# EAGLE design mrShark Adapter (EAGLE 7.2.0)
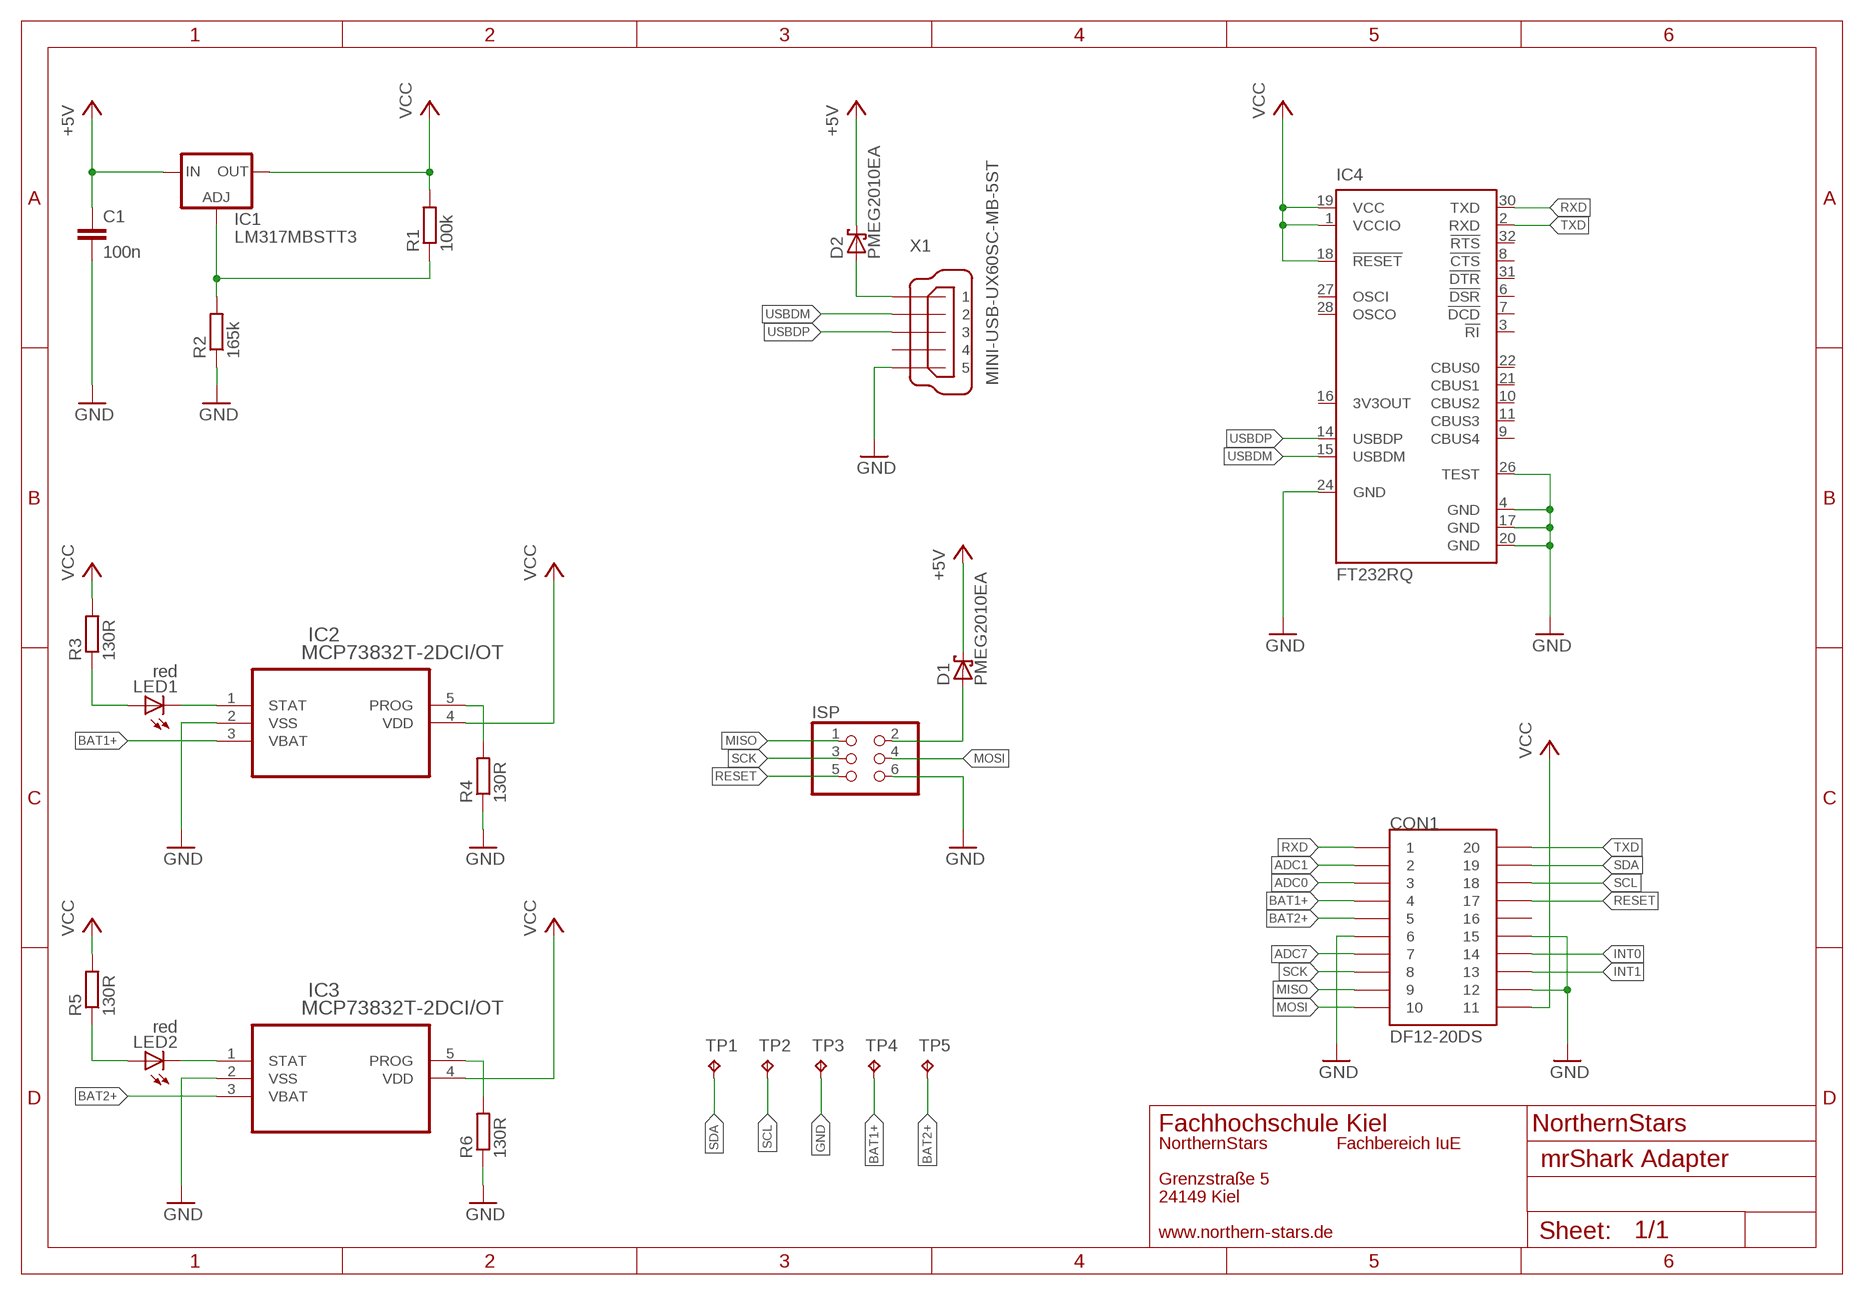
[diagram p0: schematic, sheet 1]

## Parts
C1  100n  C-EUC0603  [C0603]
CON1  DF12-20DS  [DF12-20DS]
D1  PMEG2010EA  PMEG2010EAR  [SOD323-R]
D2  PMEG2010EA  PMEG2010EAR  [SOD323-R]
IC1  LM317MBSTT3  [SOT223]
IC2  MCP73832T-2DCI/OT  [SOT95P300X145-5N]
IC3  MCP73832T-2DCI/OT  [SOT95P300X145-5N]
IC4  FT232RQ  [QFN32]
ISP  PINHD-2X03_2.54-SMD  [2X03SMD]
LED1  red  LEDCHIP-LED0603  [CHIP-LED0603]
LED2  red  LEDCHIP-LED0603  [CHIP-LED0603]
R1  100k  R-EU_R0603  [R0603]
R2  165k  R-EU_R0603  [R0603]
R3  130R  R-EU_R0603  [R0603]
R4  130R  R-EU_R0603  [R0603]
R5  130R  R-EU_R0603  [R0603]
R6  130R  R-EU_R0603  [R0603]
TP1  TPTP06SQ  [TP06SQ]
TP2  TPTP06SQ  [TP06SQ]
TP3  TPTP06SQ  [TP06SQ]
TP4  TPTP06SQ  [TP06SQ]
TP5  TPTP06SQ  [TP06SQ]
X1  MINI-USB-UX60SC-MB-5ST  [UX60SC-MB-5ST]

## Nets
+5V: C1.1 D1.C D2.C IC1.3(IN)
ADC0: CON1.3
ADC1: CON1.2
ADC7: CON1.7
BAT1+: CON1.4 IC2.3(VBAT) TP4.TP
BAT2+: CON1.5 IC3.3(VBAT) TP5.TP
GND: C1.2 CON1.6 CON1.12 CON1.15 IC2.2(VSS) IC3.2(VSS) IC4.4(GND) IC4.17(GND) IC4.20(GND) IC4.24(GND) IC4.26(TEST) ISP.6 R2.1 R4.1 R6.1 TP3.TP X1.5
INT0: CON1.14
INT1: CON1.13
MISO: CON1.9 ISP.1
MOSI: CON1.10 ISP.4
N$1: IC1.1(ADJ) R1.1 R2.2
N$2: IC2.1(STAT) LED1.C
N$3: LED1.A R3.1
N$4: D1.A ISP.2
N$5: IC2.5(PROG) R4.2
N$6: LED2.A R5.1
N$7: IC3.1(STAT) LED2.C
N$8: IC3.5(PROG) R6.2
N$9: D2.A X1.1
RESET: CON1.17 ISP.5
RXD: CON1.1 IC4.30(TXD)
SCK: CON1.8 ISP.3
SCL: CON1.18 TP2.TP
SDA: CON1.19 TP1.TP
TXD: CON1.20 IC4.2(RXD)
USBDM: IC4.15(USBDM) X1.2
USBDP: IC4.14(USBDP) X1.3
VCC: CON1.11 IC1.4(OUT) IC2.4(VDD) IC3.4(VDD) IC4.1(VCCIO) IC4.18(!RESET) IC4.19(VCC) R1.2 R3.2 R5.2
Unconnected: CON1.16 IC4.3(!RI) IC4.6(!DSR) IC4.7(!DCD) IC4.8(!CTS) IC4.9(CBUS4) IC4.10(CBUS2) IC4.11(CBUS3) IC4.16(3V3OUT) IC4.21(CBUS1) IC4.22(CBUS0) IC4.27(OSCI) IC4.28(OSCO) IC4.31(!DTR) IC4.32(!RTS) X1.4

## Notes on the sheet
- Fachhochschule Kiel | NorthernStars
- NorthernStars | Fachbereich IuE
- Grenzstraße 5
- 24149 Kiel
- www.northern-stars.de

## Library data of the parts
C1 = rcl:C-EU: CAPACITOR, European symbol
CON1 = con-hirose:DF12-20: HRS-Hirose DF12-Series 0.5mm Pitch SMT Board to Board Connector 20 contacts
D1 D2 = diode:PMEG2010EA: NXP - Low V F (MEGA) Schottky barrier diode If = 1A, Vr = 20V http://www.farnell.com/datasheets/687996.pdf
IC1 = v-reg:LM317?*: 500 mA Adjustable Output Positive Voltage Regulator Source: http://www.onsemi.co.jp .. LM317M-D.PDF
IC2 IC3 = microchip:MCP73832T-2DCI/OT: IC, BATT CHARGER, Li-Ion Li-Polymer, 500 mA; MPN: MCP73832T-2DCI/OT; OC_FARNELL: 1834892; OC_NEWARK: 84R5198; PACKAGE: SOT23-5; SUPPLIER: Microchip
IC4 = ftdichip:FT232R: Source: http://www.ftdichip.com/Documents/DataSheets/DS_FT232R_v104.pdf
ISP = pinhead-2:PINHD-2X03: PIN HEADER
LED1 LED2 = led:LED: LED OSRAM: - CHIPLED LG R971, LG N971, LY N971, LG Q971, LY Q971, LO R971, LY R971 LH N974, LH R974 LS Q976, LO Q976, LY Q976 LO Q996 - Hyper CHIPLED LW Q18S LB Q993, LB Q99A, LB R99A - SideLED LS A670, LO A670, LY A670, LG A670, LP A670 LB A673, LV A673, LT A673, LW A673 LH A674 LY A675 LS A676, LA A676, LO A676, LY A676, LW A676 LS A679, LY A679, LG A679 - Hyper Micro SIDELED® LS Y876, LA Y876, LO Y876, LY Y876 LT Y87S - SmartLED LW L88C, LW L88S LB L89C, LB L89S, LG L890 LS L89K, LO L89K, LY L89K LS L896, LA L896, LO L896, LY L896 - TOPLED LS T670, LO T670, LY T670, LG T670, LP T670 LSG T670, LSP T670, LSY T670, LOP T670, LYG T670 LG T671, LOG T671, LSG T671 LB T673, LV T673, LT T673, LW T673 LH T674 LS T676, LA T676, LO T676, LY T676, LB T676, LH T676, LSB T676, LW T676 LB T67C, LV T67C, LT T67C, LS T67K, LO T67K, LY T67K, LW E67C LS E67B, LA E67B, LO E67B, LY E67B, LB E67C, LV E67C, LT E67C LW T67C LS T679, LY T679, LG T679 LS T770, LO T770, LY T770, LG T770, LP T770 LB T773, LV T773, LT T773, LW T773 LH T774 LS E675, LA E675, LY E675, LS T675 LS T776, LA T776, LO T776, LY T776, LB T776 LHGB T686 LT T68C, LB T68C - Hyper Mini TOPLED® LB M676 - Mini TOPLED Santana® LG M470 LS M47K, LO M47K, LY M47K Source: http://www.osram.convergy.de LUXEON: - LUMILED® LXK2-PW12-R00, LXK2-PW12-S00, LXK2-PW14-U00, LXK2-PW14-V00 LXK2-PM12-R00, LXK2-PM12-S00, LXK2-PM14-U00 LXK2-PE12-Q00, LXK2-PE12-R00, LXK2-PE12-S00, LXK2-PE14-T00, LXK2-PE14-U00 LXK2-PB12-K00, LXK2-PB12-L00, LXK2-PB12-M00, LXK2-PB14-N00, LXK2-PB14-P00, LXK2-PB14-Q00 LXK2-PR12-L00, LXK2-PR12-M00, LXK2-PR14-Q00, LXK2-PR14-R00 LXK2-PD12-Q00, LXK2-PD12-R00, LXK2-PD12-S00 LXK2-PH12-R00, LXK2-PH12-S00 LXK2-PL12-P00, LXK2-PL12-Q00, LXK2-PL12-R00 Source: www.luxeon.com KINGBRIGHT: KA-3528ASYC Source: www.kingbright.com
R1-R6 = rcl:R-EU_: RESISTOR, European symbol
TP1-TP5 = testpad:TP: Test pad
X1 = con-hirose:MINI-USB-: MINI USB Connector Source: http://www.hirose.co.jp/cataloge_hp/e24000019.pdf

## Board
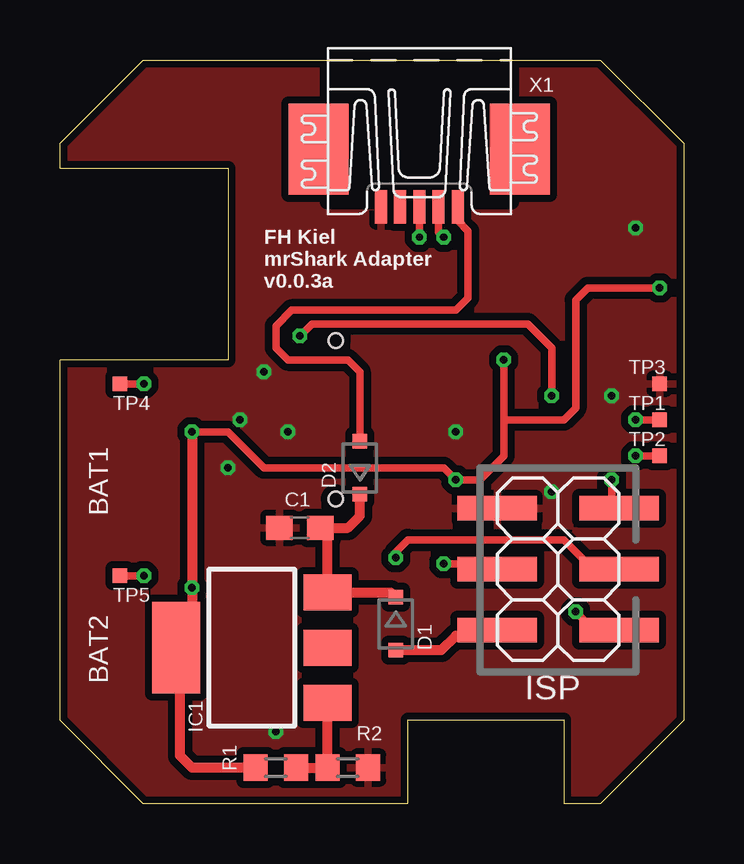
[diagram p1: board, top side]
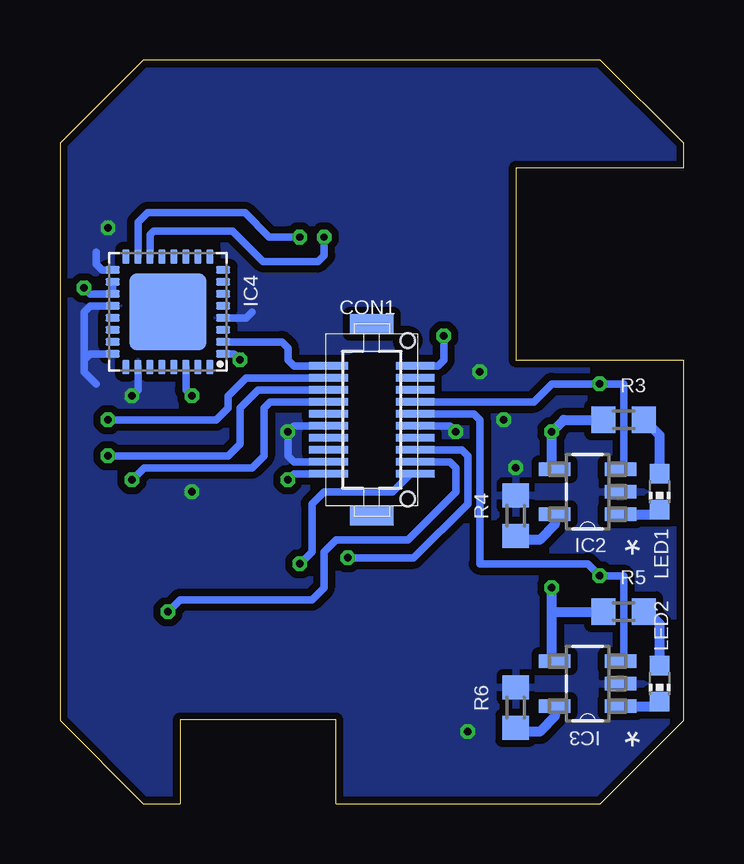
[diagram p2: board, bottom side, seen from below]

Size 26 x 31 mm. Coordinates in mm from the lower left corner, seen from the top.
Outline: 0,3.47 0,18.5 7,18.5 7,26.5 0,26.5 0,27.53 3.47,31 22.53,31 26,27.53 26,3.47 22.53,0 21,0 21,3.5 14.5,3.5 14.5,0 3.47,0 0,3.47
Copper layers (1*16): Top 0.035mm / dielectric 1.5mm / Bottom 0.035mm
Design rules "dirt_cheap_dirty_boards.v1": minimum track width 5mil, minimum drill 12mil, track to track 5mil, track to pad 5mil, pad to pad 5mil, via to via 5mil, smd to smd 0mil, copper to edge 10mil, drill to drill 10mil, minimum pad ring 10mil, minimum via ring 6mil, stop-mask expansion 2mil, vias tented up to drill 25mil, thermal gap 10mil

### Footprints (pad centres in the part's own frame; a part is rotated, then mirrored left to right if it is on the bottom)
C0603 = smd 1.1 x 1: 1 -0.85,0; 2 0.85,0
DF12-20DS = smd 0.32 x 1.62: 1 -2.25,1.81; 2 -1.75,1.81; 3 -1.25,1.81; 4 -0.75,1.81; 5 -0.25,1.81; 6 0.25,1.81; 7 0.75,1.81; 8 1.25,1.81; 9 1.75,1.81; 10 2.25,1.81; 11 2.25,-1.81; 12 1.75,-1.81; 13 1.25,-1.81; 14 0.75,-1.81; 15 0.25,-1.81; 16 -0.25,-1.81; 17 -0.75,-1.81; 18 -1.25,-1.81; 19 -1.75,-1.81; 20 -2.25,-1.81 | smd 0.8 x 1.8: T1 -4,0; T2 4,0 | hole 0.6: -3.3,1.5; 3.3,1.5
SOD323-R = smd 0.6 x 0.6: A 1.1,0; C -1.1,0
SOT223 = smd 1.5 x 2: 1 -2.3,-3.15; 2 0,-3.15; 3 2.3,-3.15 | smd 3.8 x 2: 4 0,3.15
SOT95P300X145-5N = smd 1.321 x 0.559: 1 -1.372,0.94; 2 -1.372,0; 3 -1.372,-0.94; 4 1.372,-0.94; 5 1.372,0.94
QFN32 = smd 0.6 x 0.3: 1 -2.3,1.75; 2 -2.3,1.25; 3 -2.3,0.75; 4 -2.3,0.25; 5 -2.3,-0.25; 6 -2.3,-0.75; 7 -2.3,-1.25; 8 -2.3,-1.75; 17 2.3,-1.75; 18 2.3,-1.25; 19 2.3,-0.75; 20 2.3,-0.25; 21 2.3,0.25; 22 2.3,0.75; 23 2.3,1.25; 24 2.3,1.75 | smd 0.3 x 0.6: 9 -1.75,-2.3; 10 -1.25,-2.3; 11 -0.75,-2.3; 12 -0.25,-2.3; 13 0.25,-2.3; 14 0.75,-2.3; 15 1.25,-2.3; 16 1.75,-2.3; 25 1.75,2.3; 26 1.25,2.3; 27 0.75,2.3; 28 0.25,2.3; 29 -0.25,2.3; 30 -0.75,2.3; 31 -1.25,2.3; 32 -1.75,2.3 | smd 3.2 x 3.2: EXP 0,0
2X03SMD = smd 1.016 x 3.302: 1 -1.27,-3.81; 2 -1.27,1.27; 3 1.27,-3.81; 4 1.27,1.27; 5 3.81,-3.81; 6 3.81,1.27
CHIP-LED0603 = smd 0.8 x 0.8: A 0,-0.75; C 0,0.75
R0603 = smd 1 x 1.1: 1 -0.85,0; 2 0.85,0
TP06SQ = smd 0.6 x 0.6: TP 0,0
UX60SC-MB-5ST = smd 1.4 x 0.5: 1 6.1,1.6; 2 6.1,0.8; 3 6.1,0; 4 6.1,-0.8; 5 6.1,-1.6 | smd 3.8 x 2.5: M1 3.7,-4.2; M2 3.7,4.2

### Placement (x,y rotation side)
C1  10,11.5 180 top
CON1  13,16 270 bottom
D1  14,7.5 270 top
D2  12.5,14 90 top
IC1  8,6.5 90 top
IC2  4,13 180 bottom
IC3  4,5 180 bottom
IC4  21.5,20.5 180 bottom
ISP  19.5,8.5 90 top
LED1  1,13 180 bottom
LED2  1,5 180 bottom
R1  9,1.5 180 top
R2  12,1.5 180 top
R3  2.5,16 180 bottom
R4  7,12 270 bottom
R5  2.5,8 180 bottom
R6  7,4 270 bottom
TP1  25,16 0 top
TP2  25,14.5 0 top
TP3  25,17.5 0 top
TP4  2.5,17.5 0 top
TP5  2.5,9.5 0 top
X1  14.99,30.98 270 top

### Tracks (layer width: path | path; a pad name or v marks a point on that pad's centre or on a via)
+5V
  Top 0.406: D1.C 13.8,8.8 IC1.3 11.15,11.2 C1.1 12,11.5 12.5,12 D2.C
BAT1+  (via drill 0.3)
  Top 0.305: v3.5,17.5 TP4.TP
  Bottom 0.305: IC2.3 2.56,13.94 2.5,14 TP4.TP v3.5,17.5 5.5,17.5 6.25,16.75 CON1.4
BAT2+  (via drill 0.3)
  Top 0.305: v3.5,9.5 TP5.TP
  Bottom 0.305: IC3.3 2.56,5.94 2.5,6 TP5.TP v3.5,9.5 4,10 8.5,10 8.5,16 8.75,16.25 CON1.5
GND  (via drill 0.3)
  Bottom 0.305: CON1.6 9.75,15.75 v9.5,15.5 | CON1.12 16.25,14.25 16.5,14.5 v16.5,15.5 16.25,15.75 CON1.15 | IC4.4 18.25,20.25 18,20.5 | IC4.26 22.75,17.25 v23,17 | IC4.24 24.75,18.75 25,18.5 | 25,18.5 25,18 24.5,17.5 | IC4.20 24.75,20.75 25,20.5 25,18.5 | IC4.17 24.25,22.25 24.5,22.5 24.5,23
  other vias: 24,24 20.5,13 7,14 7.5,16 8.5,18 9,3
  pour Top (isolate 0.305): 0.5,0 0,0 0,31 26.5,31 26.5,0.5 26.5,0
  pour Bottom (isolate 0.305): 0,0 0,31 26,31 26,0
MISO  (via drill 0.3)
  Top 0.305: v21.5,8 22,7.5 23.04,7.5 ISP.1
  Bottom 0.305: CON1.9 9.75,14.25 9.5,14 9.5,13 11.5,11 14.5,11 15,10.5 15,9 15.5,8.5 21,8.5 v21.5,8
MOSI  (via drill 0.3)
  Top 0.305: v16,10 18,10 ISP.4
  Bottom 0.305: v16,10 15.5,10.5 15.5,12.5 15,13 12.14,13 11.39,13.75 CON1.10
N$1
  Top 0.406: R1.1 R2.2 IC1.1
N$2
  Bottom 0.406: IC2.1 1.19,12.06 LED1.C
N$3
  Bottom 0.406: LED1.A 1,15.35 R3.1
N$4
  Top 0.406: D1.A 15.9,6.4 16.5,7 18,7 ISP.2
N$5
  Bottom 0.406: IC2.5 5.37,11.63 6,11 6.85,11 R4.2
N$6
  Bottom 0.406: LED2.A 1,7.5 1.5,8 R5.1
N$7
  Bottom 0.406: IC3.1 1.19,4.06 LED2.C
N$8
  Bottom 0.406: IC3.5 5.37,3.63 6,3 6.85,3 R6.2
N$9
  Top 0.305: D2.A 12.5,18 12,18.5 9.5,18.5 9,19 9,19.91 9.65,20.57 16.51,20.57 17.02,21.07 17.02,23.87 16.59,24.3 X1.1
RESET  (via drill 0.3)
  Top 0.305: v23,13.5 23,12.62 ISP.5
  Bottom 0.305: CON1.17 17.25,16.75 17.5,16.5 17.5,14.5 18,14 22.5,14 v23,13.5
RXD  (via drill 0.3)
  Top 0.305: v20.5,17 20.5,19 19.5,20 10.5,20 v10,19.5
  Bottom 0.305: IC4.30 20.75,17.25 v20.5,17 | CON1.1 10.25,18.25 10,18.5 v10,19.5
SCK  (via drill 0.3)
  Top 0.305: ISP.3 23.08,10 22,10 21,11 14.5,11 14,10.5 v14,10.25
  Bottom 0.305: CON1.8 9.25,14.75 9,14.5 9,12.5 11.25,10.25 v14,10.25
SCL  (via drill 0.3)
  Top 0.305: v24,14.5 TP2.TP
  Bottom 0.305: CON1.18 17.75,17.25 18.5,16.5 18.5,15 19,14.5 v24,14.5
SDA  (via drill 0.3)
  Top 0.305: v24,16 TP1.TP
  Bottom 0.305: CON1.19 18.25,17.75 19,17 19,16.5 19.5,16 v24,16
TXD
  Bottom 0.305: IC4.2 16.75,19.25 16.5,19 16.5,18.5 16.25,18.25 CON1.20
USBDM  (via drill 0.3)
  Top 0.305: X1.2 15.79,23.83 v16,23.61
  Bottom 0.305: IC4.15 22.75,24.23 22.35,24.63 18.29,24.63 17.27,23.61 16.51,23.61 v16,23.61
USBDP  (via drill 0.3)
  Top 0.305: v14.99,23.61 X1.3
  Bottom 0.305: IC4.14 22.25,23.72 22.1,23.87 18.8,23.87 17.53,22.6 15.24,22.6 14.99,22.85 v14.99,23.61
VCC  (via drill 0.3)
  Top 0.305: 18.5,16 18.5,14.5 17.5,13.5 v16.5,13.5 16,14 8.5,14 7,15.5 v5.5,15.5 | 18.5,16 v18.5,18.5 | v25,21.5 22,21.5 21.5,21 21.5,16.5 21,16 18.5,16
  Top 0.406: R1.2 5.5,1.5 5,2 5,6.35 IC1.4 5.5,7.15 v5.5,9 v5.5,15.5
  Bottom 0.305: IC4.18 IC4.19 24.75,21.25 v25,21.5 | IC4.1 18.75,18.75 v18.5,18.5 | CON1.11 16.25,13.75 v16.5,13.5
  Bottom 0.406: 5.5,8 R5.2 | 5.5,8 5.5,6 5.44,5.94 IC3.4 | IC2.4 5.44,13.94 5.5,14 v5.5,15.5 5,16 R3.2 | 5.5,8 v5.5,9

### Text on the board
tNames: FH Kiel / mrShark Adapter / v0.0.3a | BAT1 | BAT2